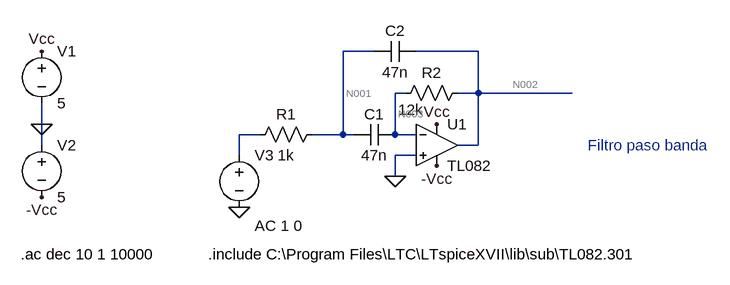
[diagram p0: schematic Filtro paso banda.asc]
Filtro paso banda.asc, the LTspice schematic file:
Version 4
SHEET 1 880 680
WIRE 160 0 112 0
WIRE 320 0 224 0
WIRE 208 64 192 64
WIRE 320 64 320 0
WIRE 320 64 288 64
WIRE 464 64 320 64
WIRE -352 112 -352 80
WIRE -16 128 -48 128
WIRE 112 128 112 0
WIRE 112 128 64 128
WIRE 128 128 112 128
WIRE 192 128 192 64
WIRE 224 128 192 128
WIRE -352 144 -352 112
WIRE 320 144 320 64
WIRE 320 144 288 144
WIRE -48 160 -48 128
WIRE 224 160 192 160
WIRE 192 192 192 160
FLAG -352 112 0
FLAG -352 0 Vcc
FLAG -352 224 -Vcc
FLAG 256 112 Vcc
FLAG 256 176 -Vcc
FLAG 192 192 0
FLAG -48 240 0
SYMBOL Opamps\\opamp2 256 80 R0
SYMATTR InstName U1
SYMATTR Value TL082
SYMBOL voltage -352 -16 R0
WINDOW 123 0 0 Left 0
WINDOW 39 0 0 Left 0
SYMATTR InstName V1
SYMATTR Value 5
SYMBOL voltage -352 128 R0
WINDOW 123 0 0 Left 0
WINDOW 39 0 0 Left 0
SYMATTR InstName V2
SYMATTR Value 5
SYMBOL cap 192 112 R90
WINDOW 0 0 32 VBottom 2
WINDOW 3 32 32 VTop 2
SYMATTR InstName C1
SYMATTR Value 47n
SYMBOL res 80 112 R90
WINDOW 0 0 56 VBottom 2
WINDOW 3 32 56 VTop 2
SYMATTR InstName R1
SYMATTR Value 1k
SYMBOL res 304 48 R90
WINDOW 0 0 56 VBottom 2
WINDOW 3 26 88 VTop 2
SYMATTR InstName R2
SYMATTR Value 12k
SYMBOL cap 224 -16 R90
WINDOW 0 0 32 VBottom 2
WINDOW 3 32 32 VTop 2
SYMATTR InstName C2
SYMATTR Value 47n
SYMBOL voltage -48 144 R0
WINDOW 123 24 124 Left 2
WINDOW 39 0 0 Left 0
WINDOW 3 24 44 Invisible 2
SYMATTR Value2 AC 1 0
SYMATTR Value 0
SYMATTR InstName V3
TEXT -96 312 Left 2 !.include C:\\Program Files\\LTC\\LTspiceXVII\\lib\\sub\\TL082.301
TEXT -384 312 Left 2 !.ac dec 10 1 10000
TEXT 488 144 Left 2 ;Filtro paso banda

The netlist it stands for:
* Filtro paso banda.asc
XU1 0 N003 Vcc -Vcc N002 TL082  ; pins In+ In- V+ V- OUT
V1 Vcc 0 5
V2 0 -Vcc 5
C1 N003 N001 47n
R1 N001 N004 1k
R2 N002 N003 12k
C2 N002 N001 47n
V3 N004 0 0 AC 1 0
.include C:\Program Files\LTC\LTspiceXVII\lib\sub\TL082.301
.ac dec 10 1 10000
* Filtro paso banda
.backanno
.end

* Results of the author's LTspice run, read from the files saved beside the schematic
* Operating Point, zero values left out:
*   V(n002) = 11.39 µV
*   V(-vcc) = -5 V
*   V(vcc) = 5 V
*   V(n003) = 10.97 µV
*   I(R2) = 35.05 pA
*   I(V2) = -4.862 mA
*   I(V1) = -4.861 mA
*   Ix(u1:1) = 35.05 pA
*   Ix(u1:2) = 35.05 pA
*   Ix(u1:3) = 4.861 mA
*   Ix(u1:4) = -4.862 mA
*   Ix(u1:5) = -35.05 pA
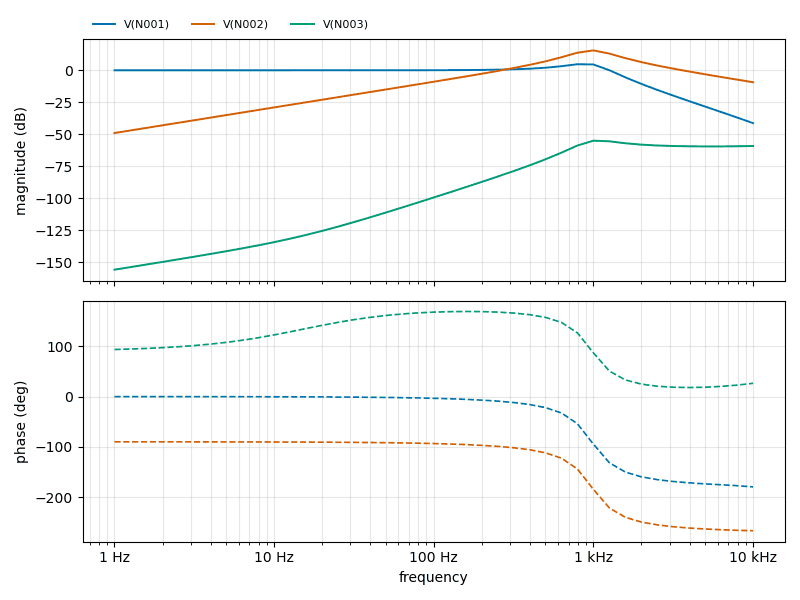
[diagram p1: AC Analysis of Filtro paso banda.asc, plotted from the saved traces]
* AC Analysis, 1 run:
*   V(N001): 0.00 dB at 1 Hz, -41.29 dB at 10 kHz, peak 4.74 dB at 794.3 Hz, 3 dB below the peak at 462.1 Hz and 1.154 kHz
*   V(N002): -49.01 dB at 1 Hz, -9.33 dB at 10 kHz, peak 15.54 dB at 1 kHz, 3 dB below the peak at 734.2 Hz and 1.302 kHz
*   V(N003): -155.78 dB at 1 Hz, -59.13 dB at 10 kHz, peak -54.98 dB at 1 kHz, 3 dB below the peak at 833.2 Hz and 1.955 kHz